# EasyEDA Pro project IC555timer.eprj

# Schematic Schematic1
Create Date: 2023-09-21; Page Name: P1; Project Name: IC555timer; Schematic Name: Schematic1; Update Date: 2023-09-22; Company: Joshua; Drawed: EasyEDA Pro; Page Size: A4; Part Number: JLCPCB-002; Version: V0.1
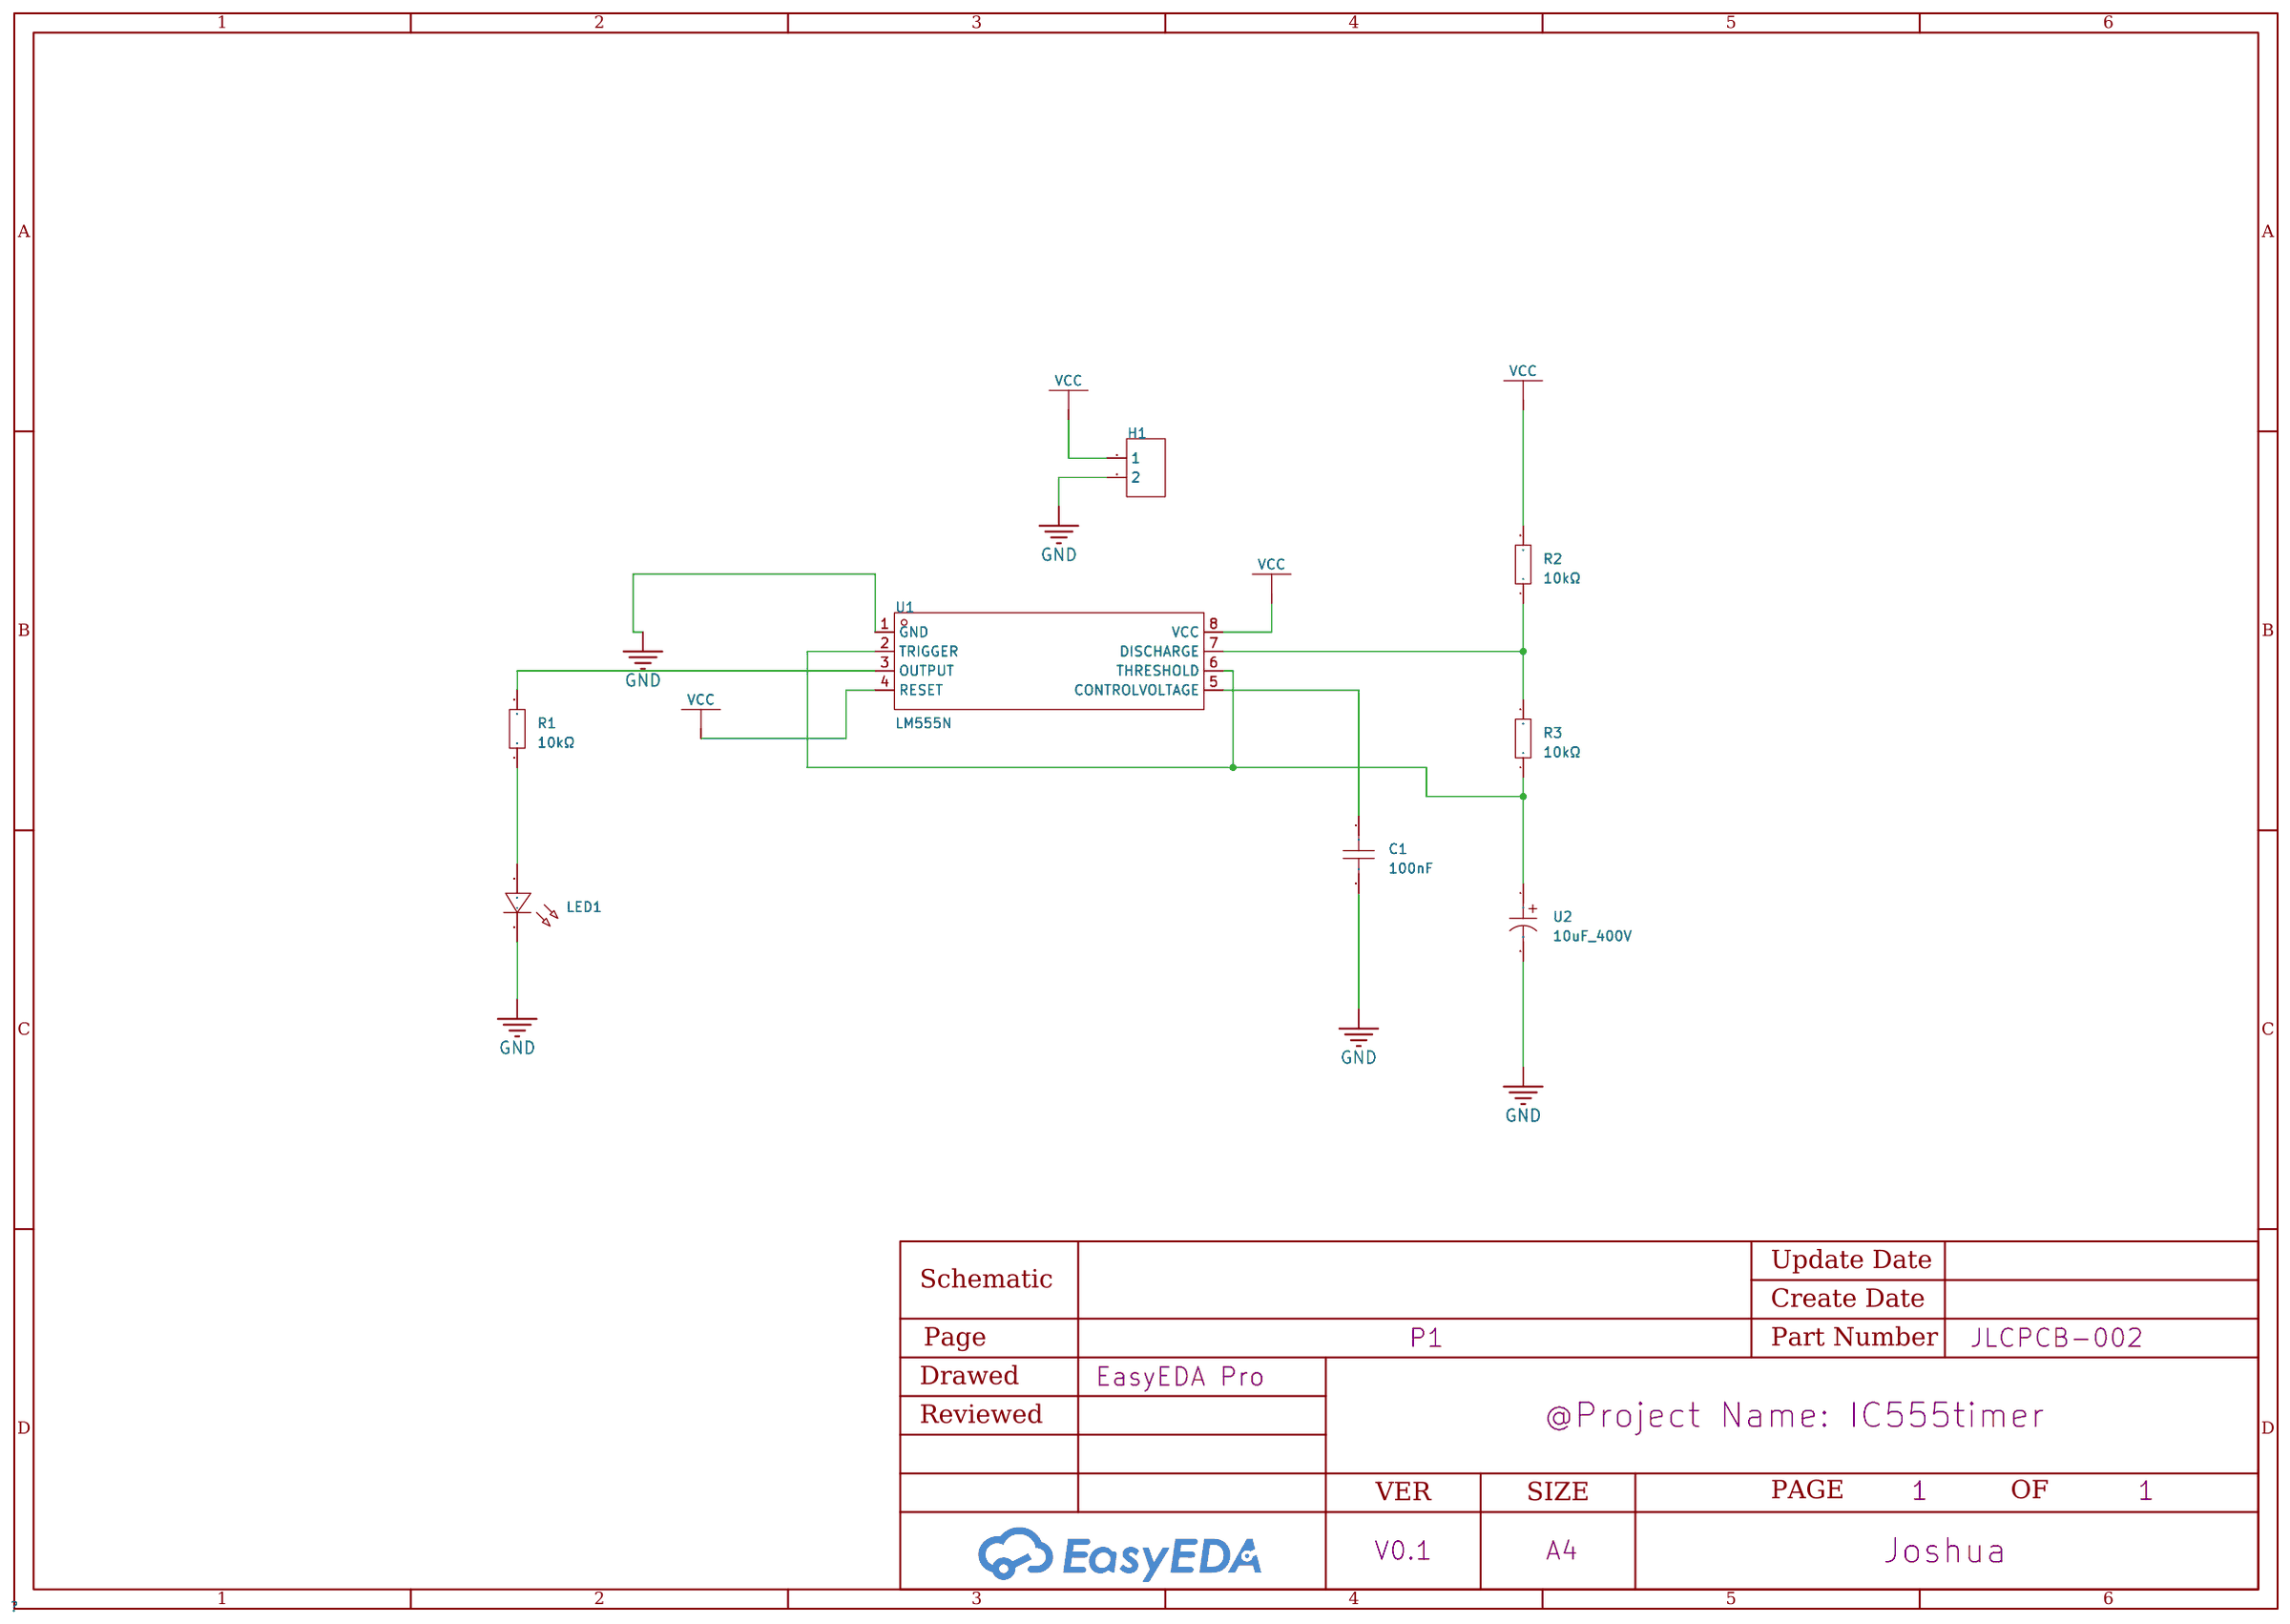
[diagram p0: schematic sheet]

## Parts
C1  100nF  [C0201]
H1  -  [HDR-TH_2P-P2.54-V-F]
LED1  -  [LED-TH_BD3.0-P2.54-FD]
R1  10kΩ  [RES-TH_BD4.5-L11.5-P15.50-D0.8]
R2  10kΩ  [RES-TH_BD4.5-L11.5-P15.50-D0.8]
R3  10kΩ  [RES-TH_BD4.5-L11.5-P15.50-D0.8]
U1  LM555N  [DIP-8_L9.7-W6.4-P2.54-LS7.6-BL]
U2  10uF_400V  [CAP-TH_BD10.0-P5.00-D0.6-FD]

## Library data of the parts
C1 = CAP_0201: Supplier Footprint: 0201
H1 = HDR-F_2.54_1x2P: Supplier Footprint: Through
LED1 = LED_TH-R_3mm: Supplier Footprint: Through
R1-R3 = Res_AXIAL-1W: Supplier Footprint: Through
U1 = LM555N: LCSC Part Name: 单精度定时器; Supplier Part: C725327; Manufacturer: HGSEMI(华冠); Supplier Footprint: DIP-8; JLCPCB Part Class: Extended Part; Datasheet: https://atta.szlcsc.com/upload/public/pdf/source/20200820/C725327_523C7FBD163769615688D4EAFE352537.pdf; Supplier: LCSC
U2 = 10uF_400V: Supplier Part: C9900016271; Supplier Footprint: Capacitor_THT:CP_Radial_D10.0mm_P5.00mm; JLCPCB Part Class: Extended Part; Datasheet: https://atta.szlcsc.comnull; Supplier: LCSC

## Nets
GND: C1.2 H1.2 LED1.2(A) U1.1(GND) U2.2
VCC: H1.1 R2.2 U1.4(RESET) U1.8(VCC)
$1N580: LED1.1(C) R1.1
$1N592: R1.2 U1.3(OUTPUT)
$1N631: R2.1 R3.2 U1.7(DISCHARGE)
$1N686: C1.1 U1.5(CONTROLVOLTAGE)
$1N690: R3.1 U1.2(TRIGGER) U1.6(THRESHOLD) U2.1

# Board PCB1
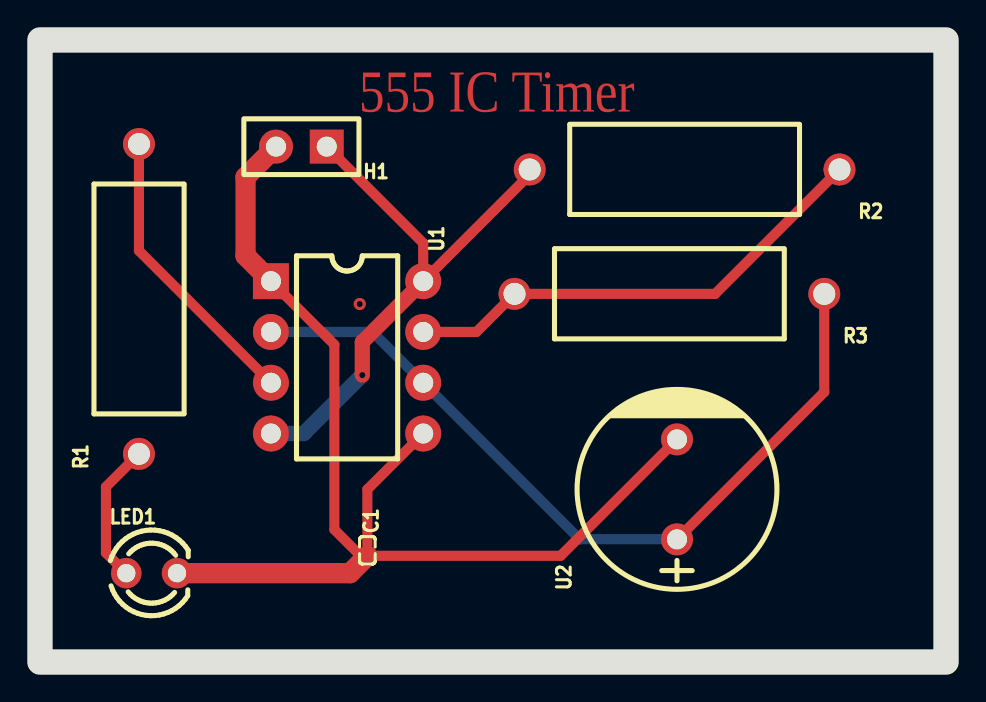
[diagram p1: board, top side]
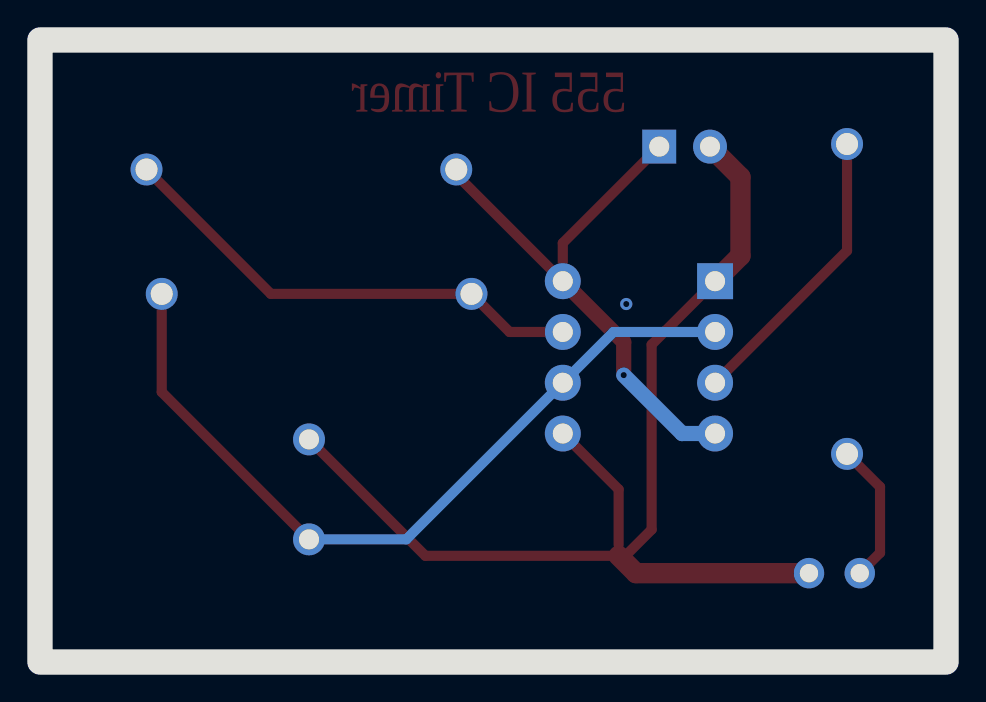
[diagram p2: board, bottom side, seen from below]

Outline 45.34 x 31.12 mm; copper layers: Top Layer, Bottom Layer. Coordinates in mm from the lower left corner of the outline.
Outline path: rectangle 0,31.12 45.34,0
Stack: Top Layer 0.035mm / Dielectric1 1.51mm FR4 er 4.5 / Bottom Layer 0.035mm

## Design rules (mm)
template: JLCPCB Capability(Two Layers Board)
spacing copperThickness1oz (default): track to track 0.102, other pairs 0.152 to 0.3
spacing copperThickness2oz: track to track 0.203, other pairs 0.152 to 0.3
track width copperThickness1oz (default): min 0.127, default 0.254, max 2.54
track width copperThickness2oz: min 0.203, default 0.254, max 2.54
differential pair differentialPair (default): width min 0.127, default 0.254, max 2.54; gap min 0.152, default 0.152
via viaSize (default): diameter min 0.5, default 0.61, max 10; hole min 0.3, default 0.305, max 6.3

## Placement (name value [footprint] x y rotation side)
C1  100nF  [C0201]  16.38 5.59 270 top
H1  -  [HDR-TH_2P-P2.54-V-F]  13.08 25.78 180 top
LED1  -  [LED-TH_BD3.0-P2.54-FD]  5.59 4.45 0 top
R1  10kΩ  [RES-TH_BD4.5-L11.5-P15.50-D0.8]  4.95 18.16 90 top
R2  10kΩ  [RES-TH_BD4.5-L11.5-P15.50-D0.8]  32.26 24.64 180 top
R3  10kΩ  [RES-TH_BD4.5-L11.5-P15.50-D0.8]  31.5 18.42 180 top
U1  LM555N  [DIP-8_L9.7-W6.4-P2.54-LS7.6-BL]  15.37 15.24 270 top
U2  10uF_400V  [CAP-TH_BD10.0-P5.00-D0.6-FD]  31.88 8.64 90 top

## Footprints (pads in the part's own frame, mm; a bottom-side part is the same pattern mirrored in y, then rotated)
C0201
  rect 0.368x0.324 smd: 1(-0.275,0) 2(0.275,0)
CAP-TH_BD10.0-P5.00-D0.6-FD
  round 1.6 hole 1: 1(-2.5,0) 2(2.5,0)
DIP-8_L9.7-W6.4-P2.54-LS7.6-BL
  rect 1.8x1.8 hole 1: 1(-3.81,-3.81)
  round 1.8 hole 1: 2(-1.27,-3.81) 3(1.27,-3.81) 4(3.81,-3.81) 5(3.81,3.81) 6(1.27,3.81) 7(-1.27,3.81) 8(-3.81,3.81)
HDR-TH_2P-P2.54-V-F
  rect 1.7x1.7 hole 1: 1(-1.27,0)
  round 1.7 hole 1: 2(1.27,0)
LED-TH_BD3.0-P2.54-FD
  round 1.524 hole 0.914: 1(-1.27,0) 2(1.27,0)
RES-TH_BD4.5-L11.5-P15.50-D0.8
  round 1.6 hole 1.1: 1(-7.75,0) 2(7.75,0)

## Nets
As in the schematic.

## Via types
v1: diameter 0.61, hole 0.305, Top Layer to Bottom Layer, 2 vias

## Routing (per net, layer and track width the routed paths; a pad name or vN(x,y) marks a point on that pad's centre or on a via; arc(x,y) is an arc through that point)
GND: length 51.6
  Top Layer w0.508: U2.2 26.05,5.31 C1.2 16.04,5.31 14.73,6.62 14.73,15.88 11.56,19.05
  Top Layer w1.016: 11.56,19.05 10.29,20.32 10.29,24.26 H1.2 ; C1.2 15.51,4.45 LED1.2
VCC: length 28.3
  Top Layer w0.508: R2.2 24.51,24.38 19.18,19.05 19.18,20.95 H1.1
  Top Layer w0.762: 19.18,19.05 16.13,16 v1(16.13,14.35)
  Bottom Layer w0.762: U1.4 13.21,11.43 v1(16.13,14.35)
(no net):
  vias: v1(16,17.91)
$1N580: length 7.1
  Top Layer w0.508: 4.32,4.45 3.3,5.46 3.3,8.76 R1.1
$1N592: length 14.7
  Top Layer w0.508: R1.2 4.95,20.57 11.56,13.97
$1N631: length 24.2
  Top Layer w0.508: U1.7 21.84,16.51 R3.2 33.78,18.42 R2.1
$1N686: length 6.7
  Top Layer w0.508: C1.1 16.38,8.64 U1.5
$1N690: length 39.9
  Top Layer w0.508: U2.1 39.25,13.51 R3.1
  Bottom Layer w0.508: U2.1 27.01,6.14 16.64,16.51 U1.2

## Text on the board
Top Layer: 555 IC Timer
